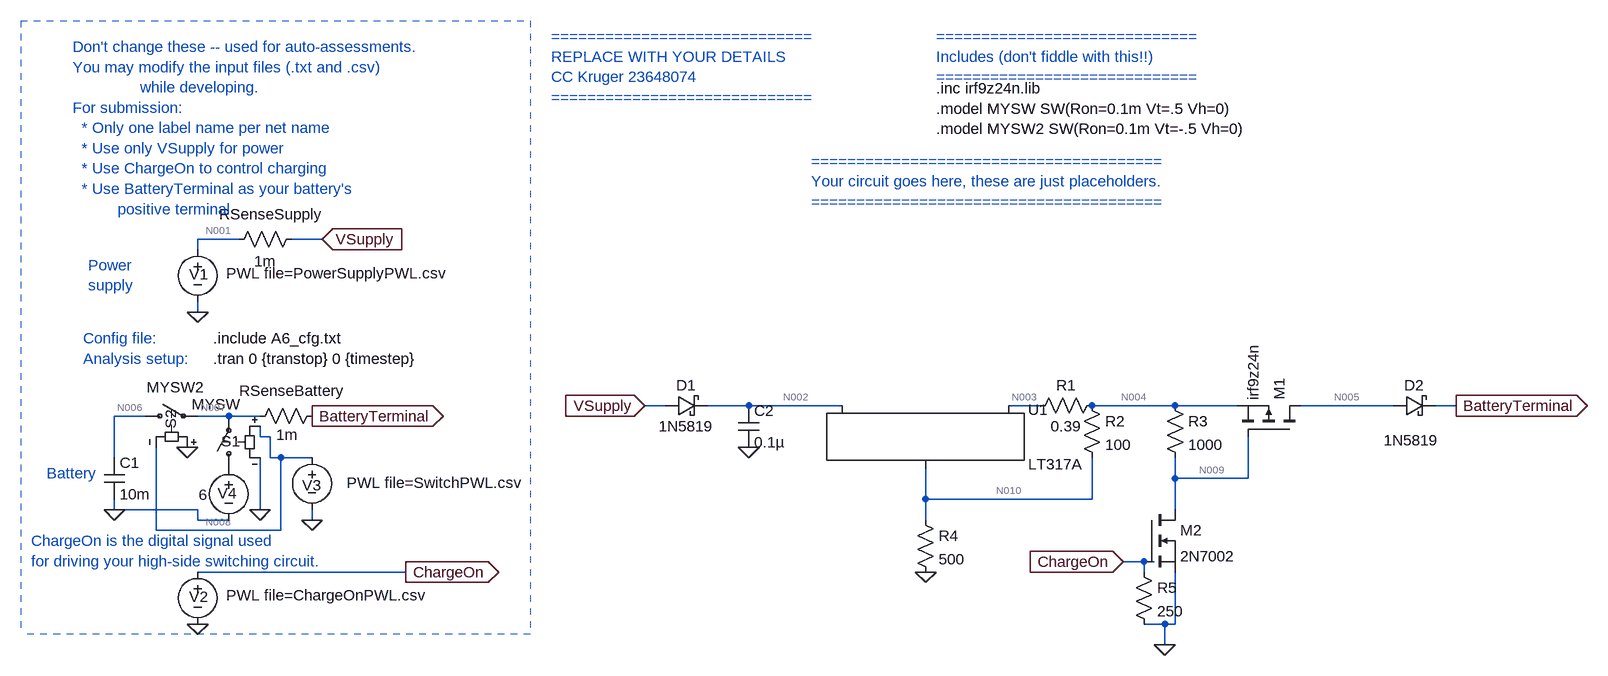
[diagram p0: schematic E344_23648074_A6b.asc]
E344_23648074_A6b.asc, the LTspice schematic file:
Version 4
SHEET 1 1824 680
WIRE -2032 -1088 -2096 -1088
WIRE -1904 -1088 -1952 -1088
WIRE -2096 -1072 -2096 -1088
WIRE -2096 -976 -2096 -992
WIRE -1376 -832 -1408 -832
WIRE -1248 -832 -1312 -832
WIRE -1104 -832 -1248 -832
WIRE -800 -832 -848 -832
WIRE -592 -832 -720 -832
WIRE -496 -832 -592 -832
WIRE -256 -832 -400 -832
WIRE -160 -832 -192 -832
WIRE -2176 -816 -2224 -816
WIRE -2048 -816 -2096 -816
WIRE -2000 -816 -2048 -816
WIRE -2000 -784 -2000 -800
WIRE -1984 -784 -2000 -784
WIRE -2224 -752 -2224 -816
WIRE -1984 -752 -1984 -784
WIRE -1968 -752 -1984 -752
WIRE -1920 -752 -1968 -752
WIRE -592 -720 -592 -752
WIRE -480 -720 -480 -784
WIRE -480 -720 -592 -720
WIRE -976 -688 -976 -736
WIRE -720 -688 -720 -752
WIRE -720 -688 -976 -688
WIRE -2224 -672 -2224 -688
WIRE -2096 -672 -2224 -672
WIRE -2000 -672 -2000 -752
WIRE -592 -672 -592 -720
WIRE -2096 -656 -2096 -672
WIRE -2048 -656 -2096 -656
WIRE -1920 -656 -1920 -672
WIRE -976 -656 -976 -688
WIRE -2160 -640 -2160 -768
WIRE -1968 -640 -1968 -752
WIRE -1968 -640 -2160 -640
WIRE -640 -592 -672 -592
WIRE -624 -592 -640 -592
WIRE -1776 -576 -2096 -576
WIRE -640 -576 -640 -592
WIRE -608 -496 -640 -496
WIRE -592 -496 -592 -576
WIRE -592 -496 -608 -496
WIRE -608 -464 -608 -496
FLAG -2096 -976 0
FLAG -1904 -1088 VSupply
IOPIN -1904 -1088 In
FLAG -1920 -816 BatteryTerminal
IOPIN -1920 -816 Out
FLAG -1776 -576 ChargeOn
IOPIN -1776 -576 Out
FLAG -2096 -496 0
FLAG -1408 -832 VSupply
IOPIN -1408 -832 In
FLAG -160 -832 BatteryTerminal
IOPIN -160 -832 Out
FLAG -672 -592 ChargeOn
IOPIN -672 -592 In
FLAG -2000 -672 0
FLAG -1920 -656 0
FLAG -2112 -768 0
FLAG -2224 -672 0
FLAG -1248 -768 0
FLAG -976 -576 0
FLAG -608 -464 0
SYMBOL voltage -2096 -1088 R0
WINDOW 123 0 0 Left 0
WINDOW 39 0 0 Left 0
WINDOW 3 44 52 Left 2
WINDOW 0 -13 54 Left 2
SYMATTR Value PWL file=PowerSupplyPWL.csv
SYMATTR InstName V1
SYMBOL res -1904 -832 R90
WINDOW 0 -7 47 VBottom 2
WINDOW 3 29 54 VTop 2
SYMATTR InstName RSenseBattery
SYMATTR Value 1m
SYMBOL res -1936 -1104 R90
WINDOW 0 -7 47 VBottom 2
WINDOW 3 34 56 VTop 2
SYMATTR InstName RSenseSupply
SYMATTR Value 1m
SYMBOL cap -2240 -752 R0
SYMATTR InstName C1
SYMATTR Value 10m
SYMATTR SpiceLine2 IC=6
SYMBOL voltage -2096 -592 R0
WINDOW 123 0 0 Left 0
WINDOW 39 0 0 Left 0
WINDOW 3 44 52 Left 2
WINDOW 0 -13 54 Left 2
SYMATTR Value PWL file=ChargeOnPWL.csv
SYMATTR InstName V2
SYMBOL PowerProducts\\LT317A -976 -832 R0
SYMATTR InstName U1
SYMBOL pmos -400 -784 M270
SYMATTR InstName M1
SYMATTR Value irf9z24n
SYMATTR Prefix X
SYMATTR SpiceModel irf9z24n
SYMBOL nmos -640 -672 R0
SYMATTR InstName M2
SYMATTR Value 2N7002
SYMBOL schottky -1376 -816 R270
WINDOW 0 32 32 VTop 2
WINDOW 3 0 32 VBottom 2
SYMATTR InstName D1
SYMATTR Value 1N5819
SYMATTR Description Diode
SYMATTR Type diode
SYMBOL schottky -256 -816 R270
WINDOW 0 32 32 VTop 2
WINDOW 3 -22 27 VBottom 2
SYMATTR InstName D2
SYMATTR Value 1N5819
SYMATTR Description Diode
SYMATTR Type diode
SYMBOL sw -2048 -720 R180
WINDOW 0 -18 57 Left 2
WINDOW 3 -17 114 Left 2
SYMATTR InstName S1
SYMATTR Value MYSW
SYMBOL voltage -1920 -768 R0
WINDOW 0 0 43 Top 2
WINDOW 3 188 70 Bottom 2
WINDOW 123 0 0 Left 0
WINDOW 39 0 0 Left 0
SYMATTR InstName V3
SYMATTR Value PWL file=SwitchPWL.csv
SYMBOL sw -2192 -816 R270
WINDOW 0 -20 55 Left 2
WINDOW 3 44 18 VRight 2
SYMATTR InstName S2
SYMATTR Value MYSW2
SYMBOL voltage -2048 -752 R0
WINDOW 0 -17 55 Left 2
WINDOW 3 -46 57 Left 2
WINDOW 123 0 0 Left 0
WINDOW 39 0 0 Left 0
SYMATTR InstName V4
SYMATTR Value 6
SYMBOL cap -1264 -832 R0
SYMATTR InstName C2
SYMATTR Value 0.1µ
SYMBOL res -992 -672 R0
SYMATTR InstName R4
SYMATTR Value 500
SYMBOL res -704 -848 R90
WINDOW 0 0 56 VBottom 2
WINDOW 3 32 56 VTop 2
SYMATTR InstName R1
SYMATTR Value 0.39
SYMBOL res -736 -848 R0
SYMATTR InstName R2
SYMATTR Value 100
SYMBOL res -608 -848 R0
SYMATTR InstName R3
SYMATTR Value 1000
SYMBOL res -656 -592 R0
SYMATTR InstName R5
SYMATTR Value 250
TEXT -2072 -904 Left 2 !.tran 0 {transtop} 0 {timestep}
TEXT -2072 -936 Left 2 !.include A6_cfg.txt
TEXT -2288 -1384 Left 2 ;Don't change these -- used for auto-assessments.\nYou may modify the input files (.txt and .csv) \n               while developing.\nFor submission: \n  * Only one label name per net name\n  * Use only VSupply for power\n  * Use ChargeOn to control charging\n  * Use BatteryTerminal as your battery's \n          positive terminal
TEXT -2272 -936 Left 2 ;Config file:
TEXT -2272 -904 Left 2 ;Analysis setup:
TEXT -2328 -728 Left 2 ;Battery
TEXT -2264 -1048 Left 2 ;Power\nsupply
TEXT -1552 -1400 Left 2 ;=============================\nREPLACE WITH YOUR DETAILS\nCC Kruger 23648074\n=============================
TEXT -960 -1320 Left 2 !.inc irf9z24n.lib\n.model MYSW SW(Ron=0.1m Vt=.5 Vh=0)\n.model MYSW2 SW(Ron=0.1m Vt=-.5 Vh=0)
TEXT -2352 -624 Left 2 ;ChargeOn is the digital signal used \nfor driving your high-side switching circuit.
TEXT -960 -1400 Left 2 ;=============================\nIncludes (don't fiddle with this!!)\n=============================
TEXT -1152 -1208 Left 2 ;=======================================\nYour circuit goes here, these are just placeholders.\n=======================================
LINE Normal -1584 -1424 -1584 -480 2
LINE Normal -2368 -1424 -1584 -1424 2
LINE Normal -1584 -480 -2368 -480 2
LINE Normal -1584 -496 -1584 -496 2
LINE Normal -2368 -1424 -2368 -480 2

The netlist it stands for:
* E344_23648074_A6b.asc
V1 N001 0 PWL file=PowerSupplyPWL.csv
RSenseBattery BatteryTerminal N007 1m
RSenseSupply VSupply N001 1m
C1 N006 0 10m IC=6
V2 ChargeOn 0 PWL file=ChargeOnPWL.csv
XU1 N010 N003 N002 LT317A
XM1 N005 N009 N004 irf9z24n irf9z24n  ; pins D G S
M2 N009 ChargeOn 0 0 2N7002
D1 VSupply N002 1N5819
D2 N005 BatteryTerminal 1N5819
S1 P001 N007 N008 0 MYSW
V3 N008 0 PWL file=SwitchPWL.csv
S2 N006 N007 0 N008 MYSW2
V4 P001 0 6
C2 N002 0 0.1µ
R4 N010 0 500
R1 N004 N003 0.39
R2 N004 N010 100
R3 N004 N009 1000
R5 ChargeOn 0 250
.model D D
.lib standard.dio
.model NMOS NMOS
.model PMOS PMOS
.lib standard.mos
.tran 0 {transtop} 0 {timestep}
.include A6_cfg.txt
* Don't change these -- used for auto-assessments.
* You may modify the input files (.txt and .csv)
*                while developing.
* For submission:
*   * Only one label name per net name
*   * Use only VSupply for power
*   * Use ChargeOn to control charging
*   * Use BatteryTerminal as your battery's
*           positive terminal
* Config file:
* Analysis setup:
* Battery
* Power
* supply
* =============================
* REPLACE WITH YOUR DETAILS
* CC Kruger 23648074
* =============================
.inc irf9z24n.lib
.model MYSW SW(Ron=0.1m Vt=.5 Vh=0)
.model MYSW2 SW(Ron=0.1m Vt=-.5 Vh=0)
* ChargeOn is the digital signal used
* for driving your high-side switching circuit.
* =============================
* Includes (don't fiddle with this!!)
* =============================
* =======================================
* Your circuit goes here, these are just placeholders.
* =======================================
.lib LTC.lib
.backanno
.end

* Results of the author's LTspice run, read from the files saved beside the schematic
* Operating Point, zero values left out:
*   V(n001) = 12 V
*   V(batteryterminal) = 6 V
*   V(n007) = 6 V
*   V(vsupply) = 12 V
*   V(n006) = 6 V
*   V(n002) = 11.79 V
*   V(n003) = 7.484 V
*   V(n010) = 6.236 V
*   V(n004) = 7.479 V
*   V(n005) = 6.001 V
*   V(n009) = 7.479 V
*   V(p001) = 6 V
*   V(n008) = 1 V
*   Id(M2) = 7.511 pA
*   Is(M2) = -7.511 pA
*   I(D2) = 672 nA
*   I(D1) = 12.47 mA
*   I(R3) = 16.47 pA
*   I(R2) = 12.43 mA
*   I(R1) = -12.43 mA
*   I(R4) = 12.47 mA
*   I(Rsensesupply) = -12.47 mA
*   I(Rsensebattery) = 672 nA
*   I(S1) = 672 nA
*   I(V4) = 672 nA
*   I(V1) = -12.47 mA
*   Ix(u1:1) = -47.51 µA
*   Ix(u1:2) = -12.43 mA
*   Ix(u1:3) = 12.47 mA
*   Ix(m1:1) = -672 nA
*   Ix(m1:2) = 1.478 pA
*   Ix(m1:3) = 672 nA
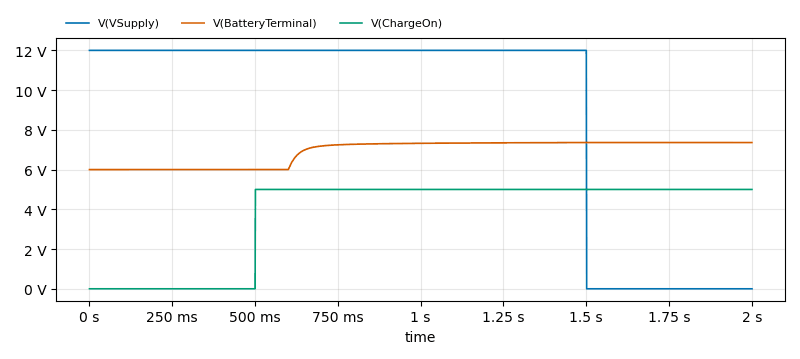
[diagram p1: Transient Analysis of E344_23648074_A6b.asc, plotted from the saved traces]
* Transient Analysis, 1 run:
*   V(VSupply): min 0 V, max 12 V, average 9.003 V, rms 10.39 V, last 0 V
*   V(BatteryTerminal): min 6 V, max 7.362 V, average 6.913 V, rms 6.939 V, last 7.36 V
*   V(ChargeOn): min 0 V, max 5 V, average 3.749 V, rms 4.329 V, last 5 V